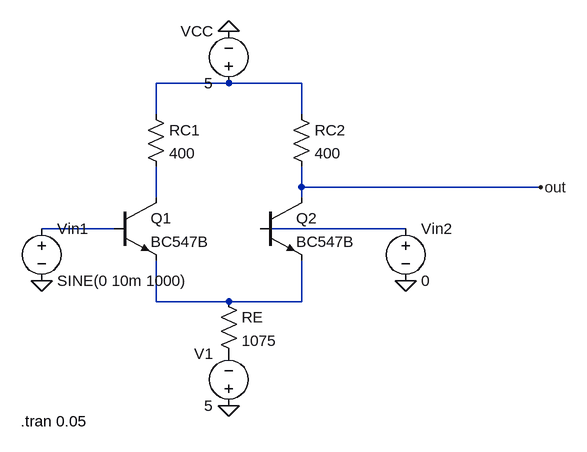
[diagram p0: schematic stage1.asc]
stage1.asc, the LTspice schematic file:
Version 4
SHEET 1 880 680
WIRE -528 -512 -640 -512
WIRE -416 -512 -528 -512
WIRE -640 -464 -640 -512
WIRE -416 -464 -416 -512
WIRE -416 -352 -416 -384
WIRE -48 -352 -416 -352
WIRE -640 -336 -640 -384
WIRE -416 -336 -416 -352
WIRE -704 -288 -816 -288
WIRE -256 -288 -480 -288
WIRE -640 -176 -640 -240
WIRE -528 -176 -640 -176
WIRE -416 -176 -416 -240
WIRE -416 -176 -528 -176
FLAG -816 -208 0
FLAG -256 -208 0
FLAG -528 -592 0
FLAG -528 -16 0
FLAG -48 -352 out
SYMBOL npn -704 -336 R0
SYMATTR InstName Q1
SYMATTR Value BC547B
SYMBOL npn -480 -336 R0
SYMATTR InstName Q2
SYMATTR Value BC547B
SYMBOL res -544 -192 R0
SYMATTR InstName RE
SYMATTR Value 1075
SYMBOL voltage -528 0 R180
WINDOW 0 24 96 Left 2
WINDOW 3 24 16 Left 2
WINDOW 123 0 0 Left 0
WINDOW 39 0 0 Left 0
SYMATTR InstName V1
SYMATTR Value 5
SYMBOL voltage -816 -304 R0
WINDOW 123 0 0 Left 0
WINDOW 39 0 0 Left 0
SYMATTR InstName Vin1
SYMATTR Value SINE(0 10m 1000)
SYMBOL voltage -256 -304 R0
WINDOW 123 0 0 Left 0
WINDOW 39 0 0 Left 0
SYMATTR InstName Vin2
SYMATTR Value 0
SYMBOL res -656 -480 R0
SYMATTR InstName RC1
SYMATTR Value 400
SYMBOL res -432 -480 R0
SYMATTR InstName RC2
SYMATTR Value 400
SYMBOL voltage -528 -496 R180
WINDOW 0 24 96 Left 2
WINDOW 3 24 16 Left 2
SYMATTR InstName VCC
SYMATTR Value 5
TEXT -848 8 Left 2 !.tran 0.05

The netlist it stands for:
* stage1.asc
Q1 N002 N003 N005 0 BC547B
Q2 out N004 N005 0 BC547B
RE N005 P001 1075
V1 0 P001 5
Vin1 N003 0 SINE(0 10m 1000)
Vin2 N004 0 0
RC1 N001 N002 400
RC2 N001 out 400
VCC N001 0 5
.model NPN NPN
.model PNP PNP
.lib standard.bjt
.tran 0.05
.backanno
.end